# EAGLE design Quectel-2560-v2.3 (EAGLE 8.5.1)
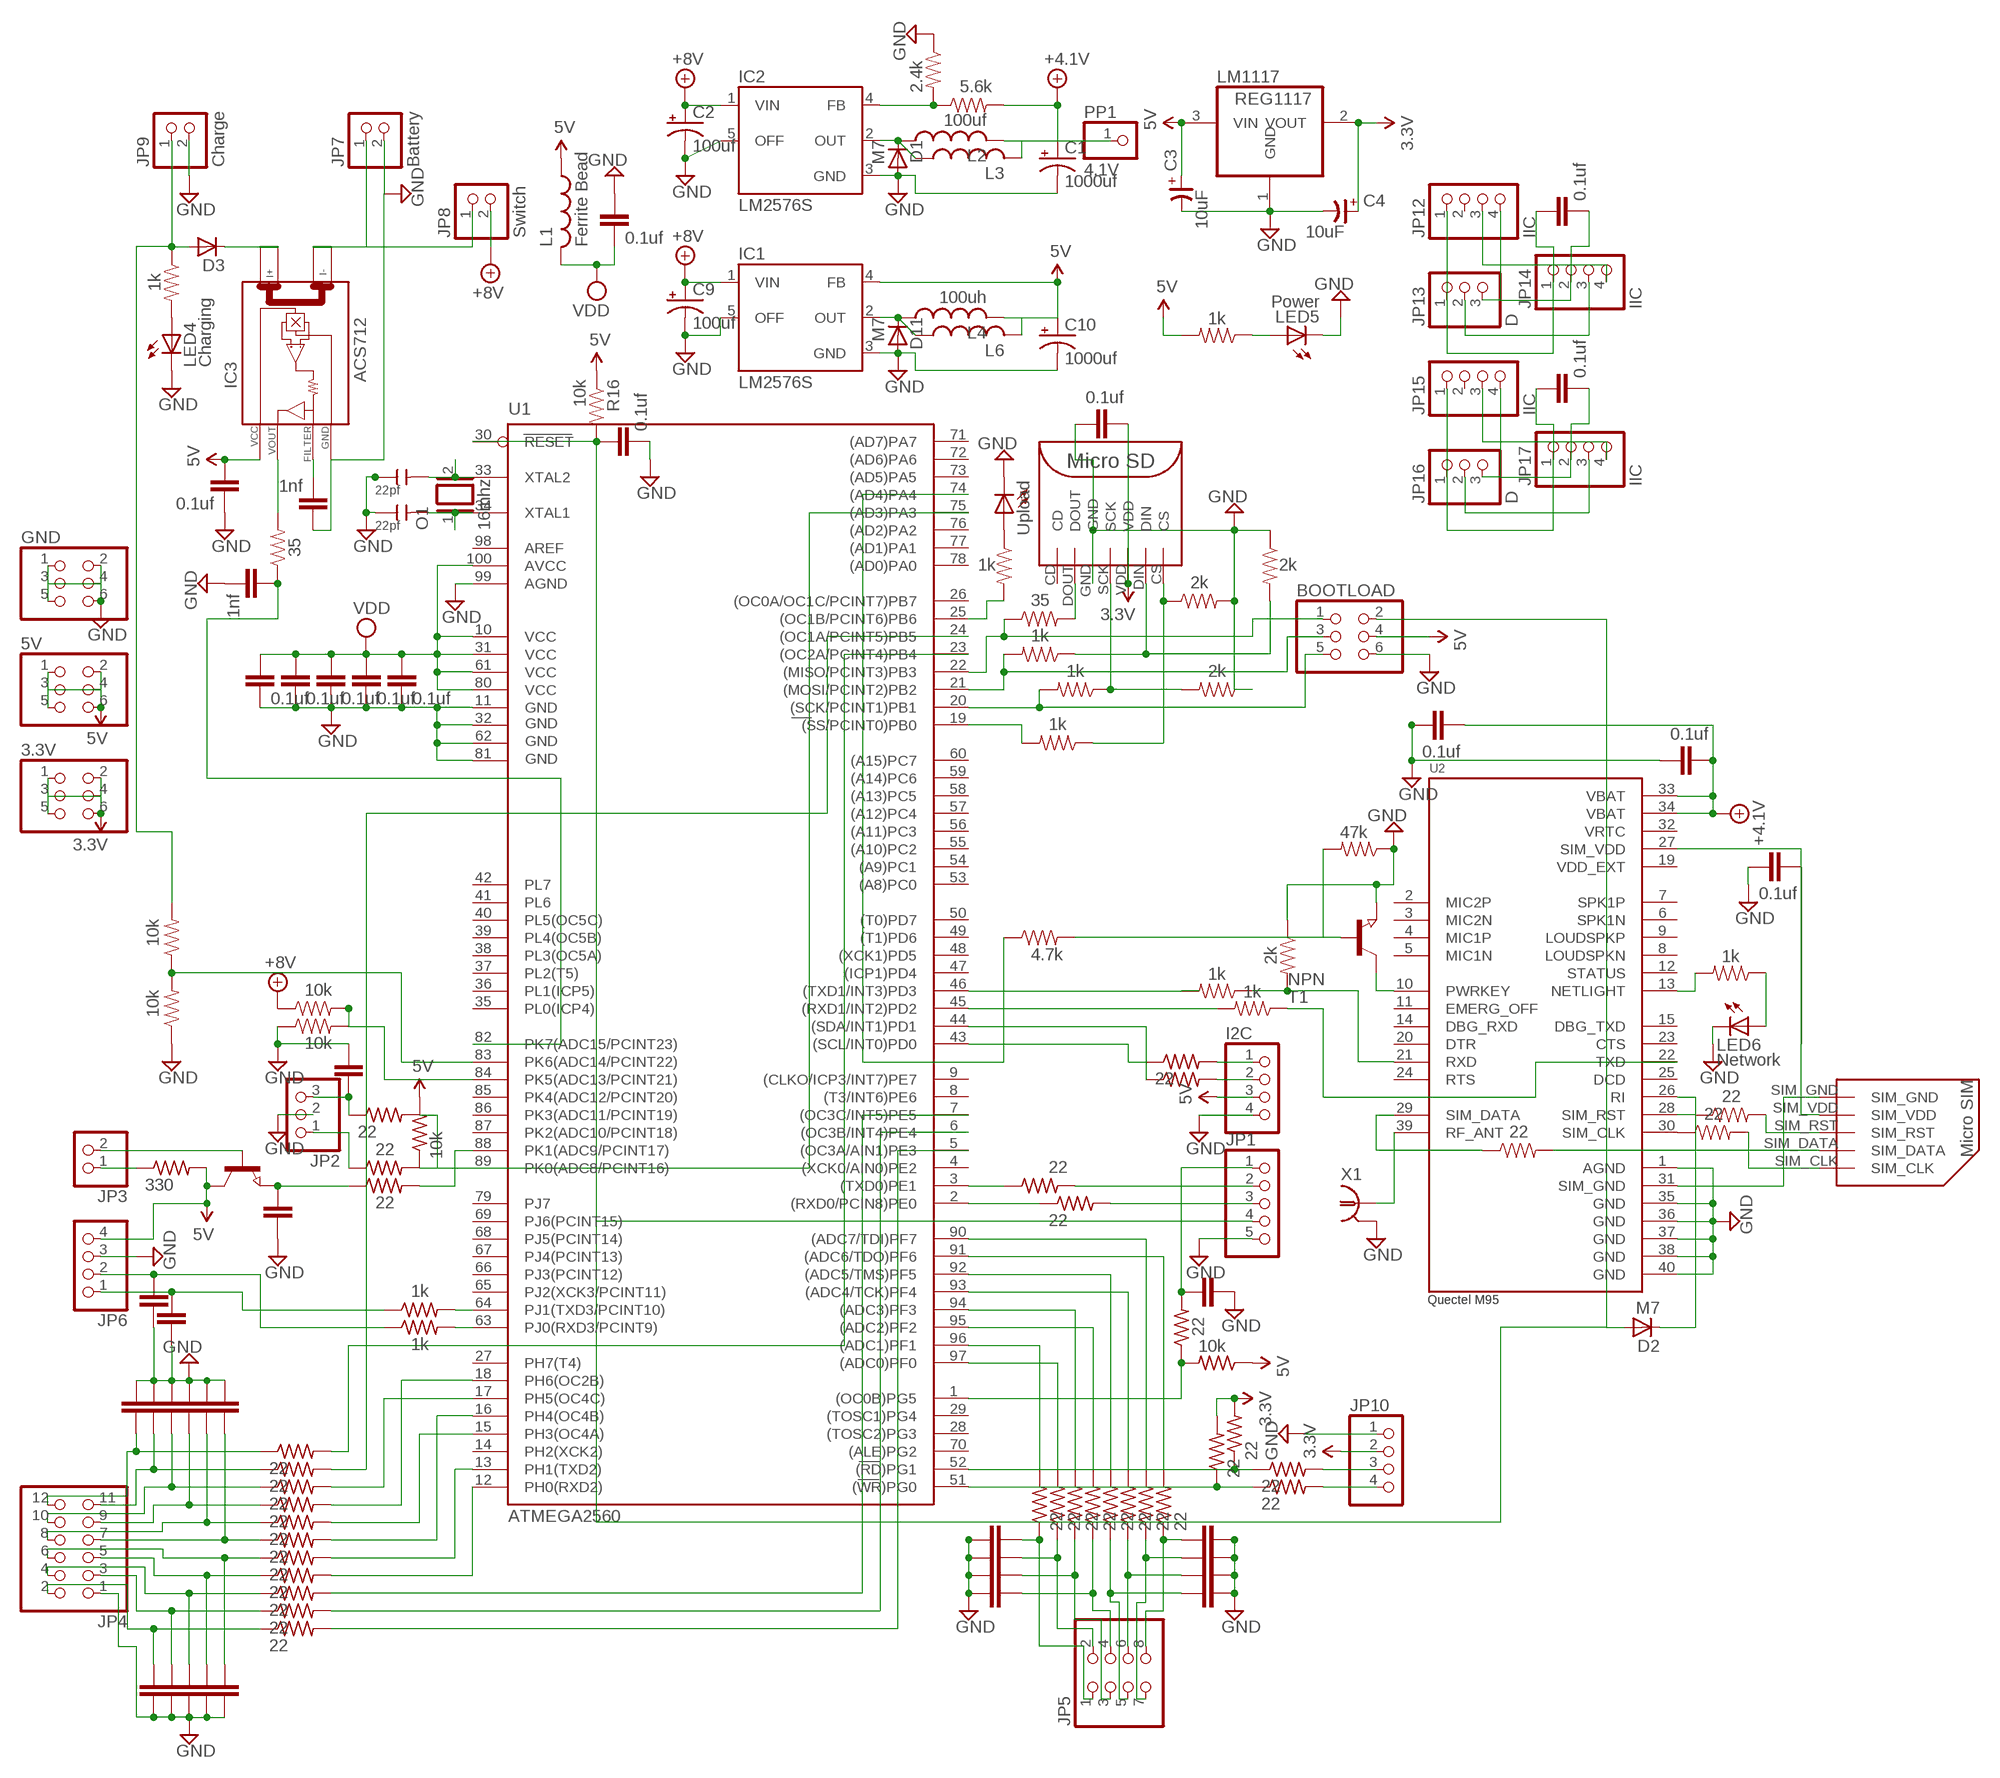
[diagram p0: schematic, sheet 1]

## Parts
3.3V  PINHD-2X3  [2X03]
5V  PINHD-2X3  [2X03]
BOOTLOAD  PINHD-2X3  [2X03]
C1  1000uf  CPOL-US153CLV-1012  [153CLV-1012]
C2  100uf  CPOL-USCT7343  [CT7343]
C3  10uF  CP-3528  [3528/T]
C4  10uF  CP-3528  [3528/T]
C7  22pf  CERAMIC-22PF-50V-5%-NPO(0805)  [C0805]
C8  22pf  CERAMIC-22PF-50V-5%-NPO(0805)  [C0805]
C9  100uf  CPOL-USCT7343  [CT7343]
C10  1000uf  CPOL-US153CLV-1012  [153CLV-1012]
D1  M7  BYS10  [SOD106A]
D2  M7  BYS10  [SOD106A]
D3  BYS10  [SOD106A]
D11  M7  BYS10  [SOD106A]
DC1  0.1uf  C-EUC0805  [C0805]
DC2  0.1uf  C-EUC0805  [C0805]
DC3  0.1uf  C-EUC0805  [C0805]
DC4  0.1uf  C-EUC0805  [C0805]
DC5  0.1uf  C-EUC0805  [C0805]
DC6  0.1uf  C-EUC0805  [C0805]
DC7  0.1uf  C-EUC0805  [C0805]
DC8  0.1uf  C-EUC0805  [C0805]
DC9  0.1uf  C-EUC0805  [C0805]
DC10  0.1uf  C-EUC0805  [C0805]
DC11  0.1uf  C-EUC0805  [C0805]
DC12  1nf  C-EUC0805  [C0805]
DC13  1nf  C-EUC0805  [C0805]
DC14  1nf  C-EUC0805  [C0805]
DC15  0.1uf  C-EUC0805  [C0805]
DC16  1nf  C-EUC0805  [C0805]
DC17  1nf  C-EUC0805  [C0805]
DC18  0.1uf  C-EUC0805  [C0805]
DC19  0.1uf  C-EUC0805  [C0805]
DC20  1nf  C-EUC0805  [C0805]
DC21  1nf  C-EUC0805  [C0805]
DC22  1nf  C-EUC0805  [C0805]
DC23  1nf  C-EUC0805  [C0805]
DC24  1nf  C-EUC0805  [C0805]
DC25  1nf  C-EUC0805  [C0805]
DC26  1nf  C-EUC0805  [C0805]
DC27  1nf  C-EUC0805  [C0805]
DC28  1nf  C-EUC0805  [C0805]
DC29  1nf  C-EUC0805  [C0805]
DC30  1nf  C-EUC0805  [C0805]
DC31  1nf  C-EUC0805  [C0805]
DC32  1nf  C-EUC0805  [C0805]
DC33  1nf  C-EUC0805  [C0805]
DC34  1nf  C-EUC0805  [C0805]
DC35  1nf  C-EUC0805  [C0805]
DC36  1nf  C-EUC0805  [C0805]
DC37  1nf  C-EUC0805  [C0805]
DC38  1nf  C-EUC0805  [C0805]
DC39  1nf  C-EUC0805  [C0805]
DC40  1nf  C-EUC0805  [C0805]
GND  PINHD-2X3  [2X03]
I2C  PINHD-1X4  [1X04]
IC1  LM2576S  [TO263-5]
IC2  LM2576S  [TO263-5]
IC3  ACS712  [SO08]
JP1  PINHD-1X5  [1X05]
JP2  PINHD-1X3  [1X03]
JP3  PINHD-1X2  [1X02]
JP4  PINHD-2X6  [2X06]
JP5  PINHD-2X4  [2X04]
JP6  PINHD-1X4  [1X04]
JP7  Battery  PINHD-1X2  [1X02]
JP8  Switch  PINHD-1X2  [1X02]
JP9  Charge  PINHD-1X2  [1X02]
JP10  PINHD-1X4  [1X04]
JP12  IIC  PINHD-1X4  [1X04]
JP13  D  PINHD-1X3  [1X03]
JP14  IIC  PINHD-1X4  [1X04]
JP15  IIC  PINHD-1X4  [1X04]
JP16  D  PINHD-1X3  [1X03]
JP17  IIC  PINHD-1X4  [1X04]
L1  Ferrite Bead  L-USL2012C  [L2012C]
L2  100uf  L-USPIS2816  [PIS2816]
L3  L-US6000-XXX-RC  [6000-XXXX-RC]
L4  100uh  L-USPIS2816  [PIS2816]
L6  L-US6000-XXX-RC  [6000-XXXX-RC]
LED2  Upload  LEDCHIP-LED0805  [CHIP-LED0805]
LED4  Charging  LEDCHIP-LED0805  [CHIP-LED0805]
LED5  Power  LEDCHIP-LED0805  [CHIP-LED0805]
LED6  Network  LEDCHIP-LED0805  [CHIP-LED0805]
LM1117  REG1117  [SOT223]
O1  16mhz  XTAL/S  [QS]
PP1  4.1V  PINHD-1X1  [1X01]
R1  35  RESISTOR0805-RES  [0805]
R2  47k  RESISTOR0805-RES  [0805]
R3  4.7k  RESISTOR0805-RES  [0805]
R4  22  R-US_R0805  [R0805]
R5  22  R-US_R0805  [R0805]
R6  1k  RESISTOR0805-RES  [0805]
R7  1k  RESISTOR0805-RES  [0805]
R8  1k  RESISTOR0805-RES  [0805]
R9  2k  RESISTOR0805-RES  [0805]
R10  22  RESISTOR0805-RES  [0805]
R11  22  RESISTOR0805-RES  [0805]
R12  22  R-US_R0805  [R0805]
R13  22  R-US_R0805  [R0805]
R14  1k  RESISTOR0805-RES  [0805]
R15  1k  RESISTOR0805-RES  [0805]
R16  10k  RESISTOR0805-RES  [0805]
R17  1k  RESISTOR0805-RES  [0805]
R18  1k  RESISTOR0805-RES  [0805]
R19  22  R-US_R0805  [R0805]
R20  22  R-US_R0805  [R0805]
R21  22  R-US_R0805  [R0805]
R22  22  R-US_R0805  [R0805]
R23  2k  RESISTOR0805-RES  [0805]
R24  2k  RESISTOR0805-RES  [0805]
R25  1k  RESISTOR0805-RES  [0805]
R26  1k  RESISTOR0805-RES  [0805]
R27  22  R-US_R0805  [R0805]
R28  22  R-US_R0805  [R0805]
R29  2k  RESISTOR0805-RES  [0805]
R30  22  R-US_R0805  [R0805]
R31  22  R-US_R0805  [R0805]
R32  22  R-US_R0805  [R0805]
R33  22  R-US_R0805  [R0805]
R34  22  R-US_R0805  [R0805]
R35  35  RESISTOR0805-RES  [0805]
R36  22  R-US_R0805  [R0805]
R37  22  R-US_R0805  [R0805]
R38  22  R-US_R0805  [R0805]
R39  22  R-US_R0805  [R0805]
R40  22  R-US_R0805  [R0805]
R41  22  R-US_R0805  [R0805]
R42  22  R-US_R0805  [R0805]
R43  10k  RESISTOR0805-RES  [0805]
R44  10k  RESISTOR0805-RES  [0805]
R45  2.4k  RESISTOR0805-RES  [0805]
R46  5.6k  RESISTOR0805-RES  [0805]
R47  22  RESISTOR0805-RES  [0805]
R48  22  R-US_R0805  [R0805]
R49  22  R-US_R0805  [R0805]
R50  10k  R-US_R0805  [R0805]
R51  22  R-US_R0805  [R0805]
R52  330  R-US_R0805  [R0805]
R53  22  R-US_R0805  [R0805]
R54  22  R-US_R0805  [R0805]
R55  10k  R-US_R0805  [R0805]
R56  10k  RESISTOR0805-RES  [0805]
R57  10k  RESISTOR0805-RES  [0805]
R58  1k  R-US_R0805  [R0805]
R59  1k  R-US_R0805  [R0805]
R60  22  R-US_R0805  [R0805]
R61  22  R-US_R0805  [R0805]
R62  22  R-US_R0805  [R0805]
R63  22  R-US_R0805  [R0805]
T1  NPN  NPN-TRANSISTOR_SOT23  [SOT23]
T2  NPN  NPN-TRANSISTOR_SOT23  [SOT23]
U1  ATMEGA2560  ATMEGA2560AU  [TQFP100]
U2  Quectel M95  M95  [XCVR_M95]
U$1  MICROSD  [MICROSD]
U$2  MICROSIM  [MICROSIM]
X1  LTI-SASF54GT  [LTI-SASF54GT]

## Nets
3.3V: 3.3V.1 3.3V.2 3.3V.3 3.3V.4 3.3V.5 3.3V.6 C4.+ DC10.2 JP10.2 LM1117.2(VOUT) R62.2 R63.2 U$1.VDD
5V: 5V.1 5V.2 5V.3 5V.4 5V.5 5V.6 BOOTLOAD.4 C3.+ C10.+ DC19.2 I2C.3 IC1.4(FB) IC3.8(VCC) JP6.4 L1.1 L4.2 L6.2 LM1117.3(VIN) R16.1 R18.2 R50.1 R52.2 R55.2 T2.3(C)
+4.1V: C1.+ DC6.2 DC7.2 L2.2 L3.2 PP1.1 R46.2 U2.33(VBAT) U2.34(VBAT)
+8V: C2.+ C9.+ IC1.1(VIN) IC2.1(VIN) JP8.2 R43.1
GND: BOOTLOAD.6 C1.- C2.- C3.- C4.- C7.1 C8.1 C9.- C10.- D1.A D11.A DC1.2 DC2.2 DC3.2 DC4.2 DC5.2 DC6.1 DC7.1 DC10.1 DC11.2 DC12.1 DC13.1 DC14.1 DC15.1 DC16.1 DC17.1 DC18.1 DC19.1 DC20.1 DC21.2 DC22.1 DC23.2 DC24.2 DC25.2 DC26.2 DC27.2 DC28.2 DC29.2 DC30.2 DC31.2 DC32.2 DC33.1 DC34.1 DC35.1 DC36.1 DC37.2 DC38.2 DC39.1 DC40.2 GND.1 GND.2 GND.3 GND.4 GND.5 GND.6 I2C.4 IC1.3(GND) IC1.5(OFF) IC2.3(GND) IC2.5(OFF) IC3.5(GND) JP1.5 JP2.2 JP4.1 JP6.3 JP7.2 JP9.2 JP10.1 LED2.C LED4.C LED5.C LED6.C LM1117.1(GND) R2.1 R9.1 R23.2 R24.1 R29.1 R44.1 R45.1 R57.1 T1.2(E) U1.11(GND) U1.32(GND1) U1.62(GND2) U1.81(GND3) U1.99(AGND) U2.1(AGND) U2.35(GND) U2.36(GND) U2.37(GND) U2.38(GND) U2.40(GND) U$1.GND X1.2 X1.3 X1.4 X1.5
N$1: U2.31(SIM_GND) U$2.SIM_GND
N$2: DC15.2 U2.27(SIM_VDD) U$2.SIM_VDD
N$3: R10.1 U2.28(SIM_RST)
N$4: R11.1 U2.30(SIM_CLK)
N$5: DC8.1 JP12.1 JP13.1 JP14.1
N$6: R10.2 U$2.SIM_RST
N$7: LED2.A R25.1
N$8: R33.1 R50.2 U1.1((OC0B)PG5)
N$9: R32.2 U1.5((OC3A/AIN1)PE3)
N$10: R7.1 R24.2 U$1.SCK
N$11: R31.2 U1.6((OC3B/INT4)PE4)
N$12: R6.1 R9.2 U$1.DIN
N$13: BOOTLOAD.2 D2.A DC11.1 JP1.4 R16.2 U1.30(RESET)
N$14: DC8.2 JP12.4 JP13.3 JP14.2
N$15: JP13.2 JP14.3
N$16: BOOTLOAD.3 R6.2 U1.21((MOSI/PCINT2)PB2)
N$17: BOOTLOAD.5 R7.2 U1.20((SCK/PCINT1)PB1)
N$18: DC21.1 R1.1 U1.82(PK7(ADC15/PCINT23))
N$19: IC3.4(I-_1) JP7.1 JP8.1
N$20: R8.2 U1.19((SS/PCINT0)PB0)
N$21: U2.39(RF_ANT) X1.1
N$22: R13.2 U1.18(PH6(OC2B))
N$23: R22.2 U1.12(PH0(RXD2))
N$25: D3.A JP9.1 R26.1 R56.2
N$26: R27.2 U1.96((ADC1)PF1)
N$27: LED4.A R26.2
N$28: IC3.7(VOUT) R1.2
N$29: R11.2 U$2.SIM_CLK
N$30: C7.2 O1.2 U1.33(XTAL2)
N$31: C8.2 O1.1 U1.34(XTAL1)
N$32: R21.2 U1.13(PH1(TXD2))
N$33: R28.2 U1.97((ADC0)PF0)
N$34: R34.2 U1.94((ADC3)PF3)
N$35: R8.1 R23.1 U$1.CS
N$36: R19.2 U1.15(PH3(OC4A))
N$37: R20.2 U1.16(PH4(OC4B))
N$38: R12.2 U1.17(PH5(OC4C))
N$39: R25.2 U1.25((OC1B/PCINT6)PB6)
N$40: R14.2 U1.46((TXD1/INT3)PD3)
N$41: R15.2 U1.45((RXD1/INT2)PD2)
N$42: R14.1 R29.2 U2.21(RXD)
N$43: R15.1 U2.22(TXD)
N$44: DC29.1 JP5.8 R40.1
N$45: R4.2 U1.23((OC2A/PCINT4)PB4)
N$46: JP12.3 JP14.4
N$47: R5.2 U1.24((OC1A/PCINT5)PB5)
N$48: R36.2 U1.95((ADC2)PF2)
N$49: BOOTLOAD.1 R35.1 U1.22((MISO/PCINT3)PB3)
N$50: R17.2 U2.13(NETLIGHT)
N$51: LED6.A R17.1
N$52: R41.1 U1.3((TXD0)PE1)
N$53: R42.1 U1.2((RXD0/PCIN8)PE0)
N$54: DC13.2 JP4.11 R5.1
N$55: DC23.1 JP1.1 R33.2
N$56: DC25.1 JP4.3 R31.1
N$57: DC27.1 JP4.5 R22.1
N$58: DC22.2 JP4.7 R20.1
N$60: LED5.A R18.1
N$61: DC16.2 JP4.9 R13.1
N$62: DC24.1 JP4.2 R32.1
N$63: JP1.2 R41.2
N$64: R35.2 U$1.DOUT
N$65: D11.K IC1.2(OUT) L4.1 L6.1
N$66: DC28.1 JP4.6 R21.1
N$67: R47.2 U$2.SIM_DATA
N$68: R47.1 U2.29(SIM_DATA)
N$69: DC17.2 JP4.8 R19.1
N$70: DC14.2 JP4.10 R12.1
N$71: DC12.2 JP4.12 R4.1
N$72: DC9.1 JP15.1 JP16.1 JP17.1
N$73: DC26.1 JP4.4 R30.1
N$74: JP1.3 R42.2
N$75: R30.2 U1.7((OC3C/INT5)PE5)
N$76: R43.2 R44.2 U1.84(PK5(ADC13/PCINT21))
N$77: D1.K IC2.2(OUT) L2.1 L3.1
N$78: IC2.4(FB) R45.2 R46.1
N$79: DC39.2 JP2.3 R51.1
N$80: I2C.1 R49.2
N$81: I2C.2 R48.2
N$82: DC9.2 JP15.4 JP16.3 JP17.2
N$83: JP15.3 JP17.4
N$84: JP16.2 JP17.3
N$85: T1.3(C) U2.10(PWRKEY)
N$86: R2.2 R3.2 T1.1(B)
N$87: R3.1 U1.74((AD4)PA4)
N$88: D2.K U2.26(RI)
N$89: DC31.1 JP5.6 R37.1
N$90: D3.K IC3.1(I+_0)
N$91: DC20.2 IC3.6(FILTER)
N$92: DC36.2 JP5.4 R36.1
N$93: DC34.2 JP5.2 R28.1
N$94: R48.1 U1.44((SDA/INT1)PD1)
N$95: R49.1 U1.43((SCL/INT0)PD0)
N$96: DC30.1 JP5.7 R39.1
N$97: DC32.1 JP5.5 R38.1
N$98: DC35.2 JP5.3 R34.1
N$99: DC33.2 JP5.1 R27.1
N$100: R38.2 U1.92((ADC5/TMS)PF5)
N$101: R37.2 U1.93((ADC4/TCK)PF4)
N$102: R39.2 U1.90((ADC7/TDI)PF7)
N$103: R40.2 U1.91((ADC6/TDO)PF6)
N$104: JP2.1 R54.1
N$105: JP3.1 R52.1
N$106: JP3.2 T2.1(B)
N$107: DC40.1 R53.1 T2.2(E)
N$108: R54.2 R55.1 U1.75((AD3)PA3)
N$109: R51.2 U1.89(PK0(ADC8/PCINT16))
N$110: R53.2 U1.88(PK1(ADC9/PCINT17))
N$111: R60.1 R62.1 U1.51((WR)PG0)
N$112: R56.1 R57.2 U1.83(PK6(ADC14/PCINT22))
N$113: R58.2 U1.64(PJ1(TXD3/PCINT10))
N$114: R59.2 U1.63(PJ0(RXD3/PCINT9))
N$115: DC38.1 JP6.1 R58.1
N$116: DC37.1 JP6.2 R59.1
N$117: R61.1 R63.1 U1.52((RD)PG1)
N$118: JP10.4 R60.2
N$119: JP10.3 R61.2
VDD: DC1.1 DC2.1 DC3.1 DC4.1 DC5.1 DC18.2 L1.2 U1.10(VCC) U1.31(VCC1) U1.61(VCC2) U1.80(VCC3) U1.100(AVCC)
Unconnected: IC3.2(I+_1) IC3.3(I-_0) JP12.2 JP15.2 U1.4((XCK0/AIN0)PE2) U1.8((T3/INT6)PE6) U1.9((CLKO/ICP3/INT7)PE7) U1.14(PH2(XCK2)) U1.26((OC0A/OC1C/PCINT7)PB7) U1.27(PH7(T4)) U1.28((TOSC2)PG3) U1.29((TOSC1)PG4) U1.35(PL0(ICP4)) U1.36(PL1(ICP5)) U1.37(PL2(T5)) U1.38(PL3(OC5A)) U1.39(PL4(OC5B)) U1.40(PL5(OC5C)) U1.41(PL6) U1.42(PL7) U1.47((ICP1)PD4) U1.48((XCK1)PD5) U1.49((T1)PD6) U1.50((T0)PD7) U1.53((A8)PC0) U1.54((A9)PC1) U1.55((A10)PC2) U1.56((A11)PC3) U1.57((A12)PC4) U1.58((A13)PC5) U1.59((A14)PC6) U1.60((A15)PC7) U1.65(PJ2(XCK3/PCINT11)) U1.66(PJ3(PCINT12)) U1.67(PJ4(PCINT13)) U1.68(PJ5(PCINT14)) U1.69(PJ6(PCINT15)) U1.70((ALE)PG2) U1.71((AD7)PA7) U1.72((AD6)PA6) U1.73((AD5)PA5) U1.76((AD2)PA2) U1.77((AD1)PA1) U1.78((AD0)PA0) U1.79(PJ7) U1.85(PK4(ADC12/PCINT20)) U1.86(PK3(ADC11/PCINT19)) U1.87(PK2(ADC10/PCINT18)) U1.98(AREF) U2.2(MIC2P) U2.3(MIC2N) U2.4(MIC1P) U2.5(MIC1N) U2.6(SPK1N) U2.7(SPK1P) U2.8(LOUDSPKN) U2.9(LOUDSPKP) U2.11(EMERG_OFF) U2.12(STATUS) U2.14(DBG_RXD) U2.15(DBG_TXD) U2.20(DTR) U2.23(CTS) U2.24(RTS) U2.25(DCD) U$1.CD

## Power pins joined to a net without a drawn wire
VDD_EXT: U2.19(VDD_EXT)
VRTC: U2.32(VRTC)

## Library data of the parts
3.3V 5V BOOTLOAD GND = pinhead:PINHD-2X3: PIN HEADER
C1 C2 C9 C10 = rcl:CPOL-US: POLARIZED CAPACITOR, American symbol
C3 C4 = cap-master:CP-: POLARIZED CAP
C7 C8 = Seeed-OPL-Capacitor:CERAMIC-22PF-50V-5%-NPO(0805): 302010151; MPN: CC0805JRNPO9BN220
D1-D3 D11 = telefunken:BYS10: DIODE; MPN: BYS10/45; OC_FARNELL: 9549188; OC_NEWARK: 96K7236
DC1-DC40 = resistor:C-EU: CAPACITOR, European symbol
I2C JP6 JP10 JP12 JP14 JP15 JP17 = pinhead:PINHD-1X4: PIN HEADER
IC1 IC2 = lm2576:LM2576: National Semiconductor <http://www.national.com> 3.0A "Simple Switcher"(c) 52kHz, Vout 1.23-37V (HV: 57V), Vin 40V (HV: 60V), 50µA standby current
IC3 = ACS712:ACS712
JP1 = pinhead:PINHD-1X5: PIN HEADER
JP2 JP13 JP16 = pinhead:PINHD-1X3: PIN HEADER
JP3 JP7-JP9 = pinhead:PINHD-1X2: PIN HEADER
JP4 = pinhead:PINHD-2X6: PIN HEADER
JP5 = pinhead:PINHD-2X4: PIN HEADER
L1-L4 L6 = rcl:L-US: INDUCTOR, American symbol
LED2 LED4-LED6 = led:LED: LED OSRAM: - CHIPLED LG R971, LG N971, LY N971, LG Q971, LY Q971, LO R971, LY R971 LH N974, LH R974 LS Q976, LO Q976, LY Q976 LO Q996 - Hyper CHIPLED LW Q18S LB Q993, LB Q99A, LB R99A - SideLED LS A670, LO A670, LY A670, LG A670, LP A670 LB A673, LV A673, LT A673, LW A673 LH A674 LY A675 LS A676, LA A676, LO A676, LY A676, LW A676 LS A679, LY A679, LG A679 - Hyper Micro SIDELED® LS Y876, LA Y876, LO Y876, LY Y876 LT Y87S - SmartLED LW L88C, LW L88S LB L89C, LB L89S, LG L890 LS L89K, LO L89K, LY L89K LS L896, LA L896, LO L896, LY L896 - TOPLED LS T670, LO T670, LY T670, LG T670, LP T670 LSG T670, LSP T670, LSY T670, LOP T670, LYG T670 LG T671, LOG T671, LSG T671 LB T673, LV T673, LT T673, LW T673 LH T674 LS T676, LA T676, LO T676, LY T676, LB T676, LH T676, LSB T676, LW T676 LB T67C, LV T67C, LT T67C, LS T67K, LO T67K, LY T67K, LW E67C LS E67B, LA E67B, LO E67B, LY E67B, LB E67C, LV E67C, LT E67C LW T67C LS T679, LY T679, LG T679 LS T770, LO T770, LY T770, LG T770, LP T770 LB T773, LV T773, LT T773, LW T773 LH T774 LS E675, LA E675, LY E675, LS T675 LS T776, LA T776, LO T776, LY T776, LB T776 LHGB T686 LT T68C, LB T68C - Hyper Mini TOPLED® LB M676 - Mini TOPLED Santana® LG M470 LS M47K, LO M47K, LY M47K Source: http://www.osram.convergy.de LUXEON: - LUMILED® LXK2-PW12-R00, LXK2-PW12-S00, LXK2-PW14-U00, LXK2-PW14-V00 LXK2-PM12-R00, LXK2-PM12-S00, LXK2-PM14-U00 LXK2-PE12-Q00, LXK2-PE12-R00, LXK2-PE12-S00, LXK2-PE14-T00, LXK2-PE14-U00 LXK2-PB12-K00, LXK2-PB12-L00, LXK2-PB12-M00, LXK2-PB14-N00, LXK2-PB14-P00, LXK2-PB14-Q00 LXK2-PR12-L00, LXK2-PR12-M00, LXK2-PR14-Q00, LXK2-PR14-R00 LXK2-PD12-Q00, LXK2-PD12-R00, LXK2-PD12-S00 LXK2-PH12-R00, LXK2-PH12-S00 LXK2-PL12-P00, LXK2-PL12-Q00, LXK2-PL12-R00 Source: www.luxeon.com KINGBRIGHT: KA-3528ASYC Source: www.kingbright.com
LM1117 = burr-brown:REG1117: 800mA and 1A Low Dropout (LDO) Positive Regulator 1.8V, 2.5V, 2.85V, 3.3V, 5V, and Adj; MPN: REG1117; OC_FARNELL: 1097566; OC_NEWARK: 14P6981
O1 = special:XTAL/S: CRYSTAL
PP1 = pinhead:PINHD-1X1: PIN HEADER
R1-R3 R6-R11 R14-R18 R23-R26 R29 R35 R43-R47 R56 R57 = SparkFun-Resistors:RESISTOR: Resistor Basic schematic elements and footprints for 0603, 1206, and PTH resistors.
R4 R5 R12 R13 R19-R22 R27 R28 R30-R34 R36-R42 R48-R55 R58-R63 = rcl:R-US_: RESISTOR, American symbol; SPICEPREFIX: R
T1 T2 = semicon-smd-ipc:NPN-TRANSISTOR_: NPN TRANSISTOR
U1 = SparkFun-DigitalIC:ATMEGA2560: Atmel 100-pin 8-bit uC 64/128/256 Kbytes FLASH 4 Kbytes EEPROM 8 Kbytes SRAM 86 General Purpose I/O pins 12-channels16-bit PWM 4 x Serial USARTs 16-channels 10-bit A/D; PROD_ID: IC-10040
U2 = M95:M95: Quad-Band GSM/GPRS Module LCC
U$1 = MicroSD:MICROSD
U$2 = MicroSD:MICROSIM
X1 = con-coax:LTI-SASF54GT: SMA vertical PCB thrue hole jack Source: Lighthorse Technologies, inc. SASF54GT.pdf; OC_FARNELL: unknown; OC_NEWARK: unknown

## Net classes
0 default: clearance 0.205 mm

## Board
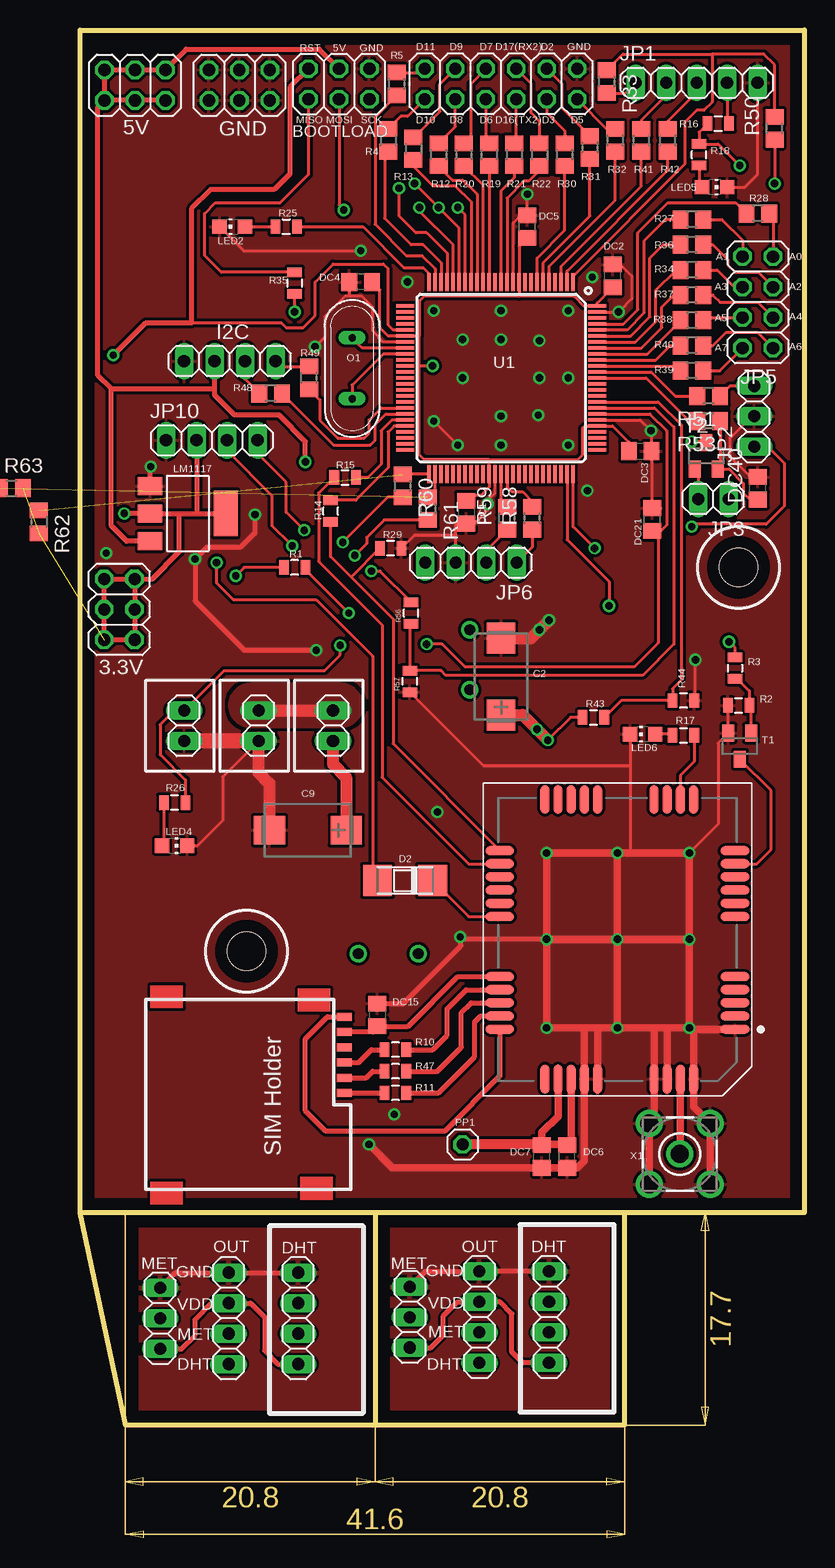
[diagram p1: board, top side]
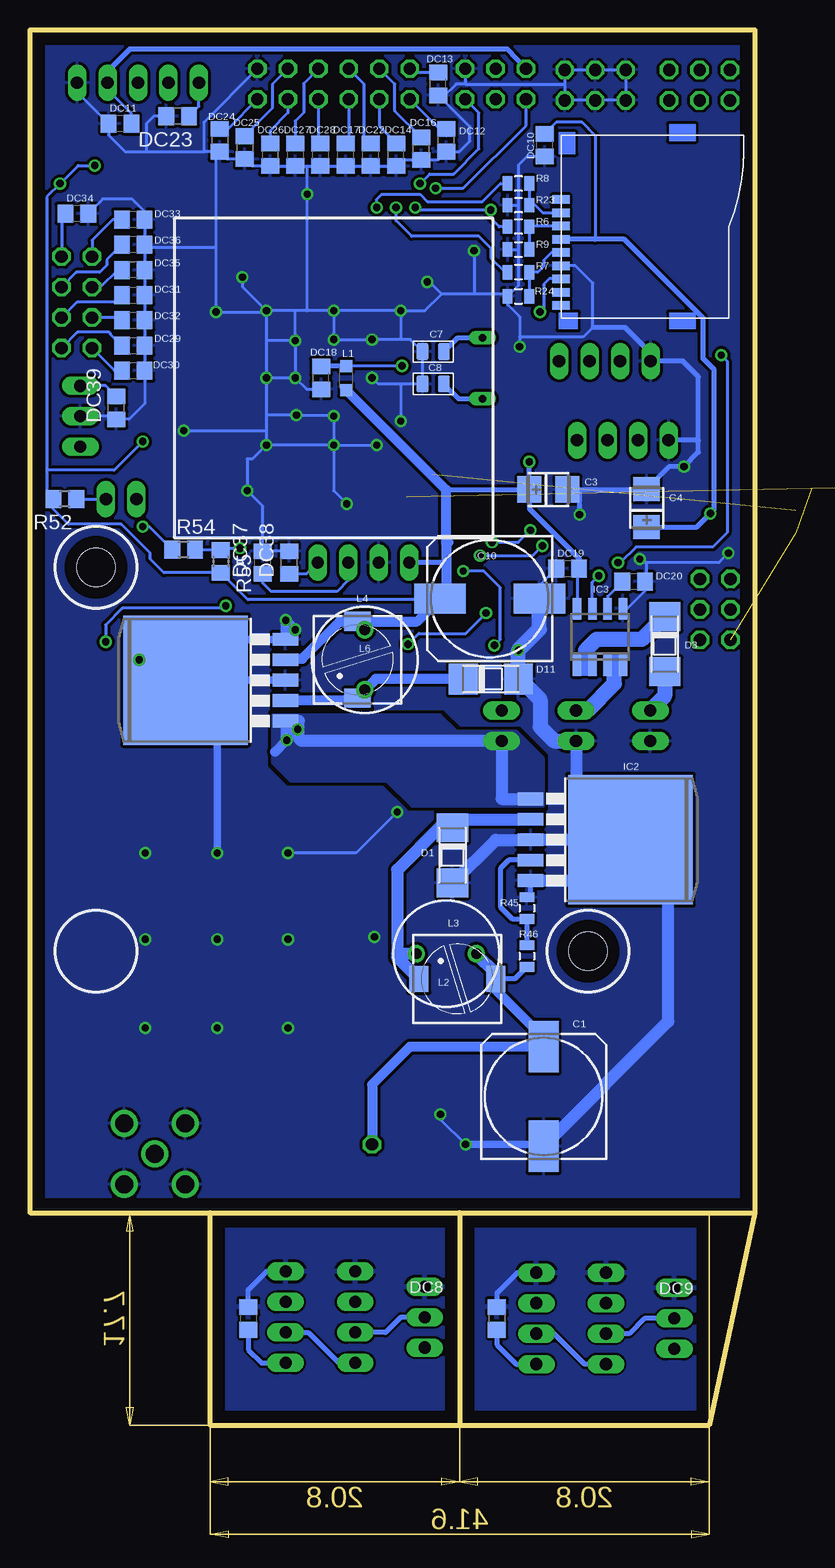
[diagram p2: board, bottom side, seen from below]

Size 60.4 x 116.3 mm. Coordinates in mm from the lower left corner, seen from the top.
Outline: 45.4,17.7 60.4,17.7 60.4,116.3 0,116.3 0,17.7
Outline: 45.4,17.7 24.6,17.7
Outline: 24.6,17.7 0,17.7
Outline: 24.6,0 45.4,0 45.4,17.7
Outline: 24.6,0 3.8,0 0,17.7
Outline: 24.6,17.7 24.6,0
Copper layers (1*16): Top 0.035mm / dielectric 1mm / Bottom 0.035mm
Design rules "Quectel-2560-v2.1": minimum track width 10mil, minimum drill 24mil, track to track 0.205mm, track to pad 0.205mm, pad to pad 0.205mm, via to via 0.205mm, smd to smd 8mil, copper to edge 40mil, drill to drill 8mil, minimum pad ring 10mil, minimum via ring 8mil, stop-mask expansion 4mil, vias tented up to drill 0mil, thermal gap 10mil
Holes 3.2 mm at 13.9,39.5 54.9,71.5

### Footprints (pad centres in the part's own frame; a part is rotated, then mirrored left to right if it is on the bottom)
2X03 = drill 1.016 octagon: 1 -2.54,-1.27; 2 -2.54,1.27; 3 0,-1.27; 4 0,1.27; 5 2.54,-1.27; 6 2.54,1.27
153CLV-1012 = smd 4.3 x 2.5: + 4.15,0; - -4.15,0
CT7343 = smd 2.6 x 2.4: + -3.2,0; - 3.2,0
3528/T = smd 2 x 2.2: + 1.587,0; - -1.587,0
C0805 = smd 1.397 x 1.016: 1 0,0.889; 2 0,-0.889
SOD106A = smd 2.4 x 2.6: A 2.3,0; K -2.3,0
C0805' = smd 1.3 x 1.5: 1 -0.95,0; 2 0.95,0
1X04 = drill 1.016 long: 1 -3.81,0; 2 -1.27,0; 3 1.27,0; 4 3.81,0
TO263-5 = smd 1.067 x 2.159: 1 -3.404,-5.791; 2 -1.702,-5.791; 3 0,-5.791; 4 1.702,-5.791; 5 3.404,-5.791 | smd 10.8 x 10.41: 6 0,2.54
SO08 = smd 0.72 x 1.78: 1 -1.905,-2.35; 2 -0.635,-2.35; 3 0.635,-2.35; 4 1.905,-2.35; 5 1.905,2.35; 6 0.635,2.35; 7 -0.635,2.35; 8 -1.905,2.35
1X05 = drill 1.016 long: 1 -5.08,0; 2 -2.54,0; 3 0,0; 4 2.54,0; 5 5.08,0
1X03 = drill 1.016 long: 1 -2.54,0; 2 0,0; 3 2.54,0
1X02 = drill 1.016 long: 1 -1.27,0; 2 1.27,0
2X06 = drill 1.016 octagon: 1 -6.35,-1.27; 2 -6.35,1.27; 3 -3.81,-1.27; 4 -3.81,1.27; 5 -1.27,-1.27; 6 -1.27,1.27; 7 1.27,-1.27; 8 1.27,1.27; 9 3.81,-1.27; 10 3.81,1.27; 11 6.35,-1.27; 12 6.35,1.27
2X04 = drill 1.016 octagon: 1 -3.81,-1.27; 2 -3.81,1.27; 3 -1.27,-1.27; 4 -1.27,1.27; 5 1.27,-1.27; 6 1.27,1.27; 7 3.81,-1.27; 8 3.81,1.27
L2012C = smd 1 x 1: 1 -1,0; 2 1,0
PIS2816 = smd 2.2 x 1.6: 1 0,3.2; 2 0,-3.2
6000-XXXX-RC = drill 0.9 pad 1.422: 1 -2.5,0; 2 2.5,0
CHIP-LED0805 = smd 1.2 x 1.2: A 0,-1.05; C 0,1.05
SOT223 = smd 1.499 x 2.007: 1 -2.261,-3.15; 2 0.025,-3.15; 3 2.311,-3.15 | smd 3.81 x 2.007: 4 0,3.15
QS = drill 0.61 long: 1 -2.54,0; 2 2.54,0
1X01 = drill 1.016 octagon: 1 0,0
0805 = smd 0.8 x 1.2: 1 -0.9,0; 2 0.9,0
R0805 = smd 1.3 x 1.5: 1 -0.95,0; 2 0.95,0
SOT23 = smd 1 x 1.4: 1 -0.95,-1.1; 2 0.95,-1.1; 3 0,1.1
TQFP100 = smd 1.5 x 0.3: 1 -8,6; 2 -8,5.5; 3 -8,5; 4 -8,4.5; 5 -8,4; 6 -8,3.5; 7 -8,3; 8 -8,2.5; 9 -8,2; 10 -8,1.5; 11 -8,1; 12 -8,0.5; 13 -8,0; 14 -8,-0.5; 15 -8,-1; 16 -8,-1.5; 17 -8,-2; 18 -8,-2.5; 19 -8,-3; 20 -8,-3.5; 21 -8,-4; 22 -8,-4.5; 23 -8,-5; 24 -8,-5.5; 25 -8,-6; 51 8,-6; 52 8,-5.5; 53 8,-5; 54 8,-4.5; 55 8,-4; 56 8,-3.5; 57 8,-3; 58 8,-2.5; 59 8,-2; 60 8,-1.5; 61 8,-1; 62 8,-0.5; 63 8,0; 64 8,0.5; 65 8,1; 66 8,1.5; 67 8,2; 68 8,2.5; 69 8,3; 70 8,3.5; 71 8,4; 72 8,4.5; 73 8,5; 74 8,5.5; 75 8,6 | smd 0.3 x 1.5: 26 -6,-8; 27 -5.5,-8; 28 -5,-8; 29 -4.5,-8; 30 -4,-8; 31 -3.5,-8; 32 -3,-8; 33 -2.5,-8; 34 -2,-8; 35 -1.5,-8; 36 -1,-8; 37 -0.5,-8; 38 0,-8; 39 0.5,-8; 40 1,-8; 41 1.5,-8; 42 2,-8; 43 2.5,-8; 44 3,-8; 45 3.5,-8; 46 4,-8; 47 4.5,-8; 48 5,-8; 49 5.5,-8; 50 6,-8; 76 6,8; 77 5.5,8; 78 5,8; 79 4.5,8; 80 4,8; 81 3.5,8; 82 3,8; 83 2.5,8; 84 2,8; 85 1.5,8; 86 1,8; 87 0.5,8; 88 0,8; 89 -0.5,8; 90 -1,8; 91 -1.5,8; 92 -2,8; 93 -2.5,8; 94 -3,8; 95 -3.5,8; 96 -4,8; 97 -4.5,8; 98 -5,8; 99 -5.5,8; 100 -6,8
XCVR_M95 = smd 2.4 x 0.75: 1 -9.8,7.5; 2 -9.8,6.4; 3 -9.8,5.3; 4 -9.8,4.2; 5 -9.8,3.1; 6 -9.8,-1.9; 7 -9.8,-3; 8 -9.8,-4.1; 9 -9.8,-5.2; 10 -9.8,-6.3; 11 -9.8,-7.4; 21 9.8,-7.4; 22 9.8,-6.3; 23 9.8,-5.2; 24 9.8,-4.1; 25 9.8,-3; 26 9.8,-1.9; 27 9.8,3.1; 28 9.8,4.2; 29 9.8,5.3; 30 9.8,6.4; 31 9.8,7.5 | smd 0.75 x 2.4: 12 -6.35,-11.65; 13 -5.25,-11.65; 14 -4.15,-11.65; 15 -3.05,-11.65; 16 1.65,-11.65; 17 2.75,-11.65; 18 3.85,-11.65; 19 4.95,-11.65; 20 6.05,-11.65; 32 6.05,11.65; 33 4.95,11.65; 34 3.85,11.65; 35 2.75,11.65; 36 1.65,11.65; 37 -3.05,11.65; 38 -4.15,11.65; 39 -5.25,11.65; 40 -6.35,11.65
MICROSD = smd 1.422 x 0.711: CD -6.35,-6.553; CS -6.35,1.143; DIN -6.35,0.051; DOUT -6.35,-4.343; GND -6.35,-3.251; P$3 -6.35,2.261; P$8 -6.35,-4.343; P$9 -6.35,-4.343; P$10 -6.35,-5.461; SCK -6.35,-2.159; VDD -6.35,-1.041
MICROSIM = smd 0.66 x 1.27: NC -3.29,9.23; SIM_CLK 0.515,9.23; SIM_DATA -0.76,9.23; SIM_GND -5.83,9.23; SIM_RST -2.025,9.23; SIM_VDD -4.565,9.23
LTI-SASF54GT = drill 1.5 pad 2.2: 1 0,0; 2 -2.54,2.54; 3 2.54,2.54; 4 2.54,-2.54; 5 -2.54,-2.54

### Placement (x,y rotation side)
3.3V  3.3,68 90 top
5V  4.6,111.7 0 top
BOOTLOAD  21.6,111.8 0 top
C1  17.6,27.4 90 bottom
C2  35.1,62.4 90 top
C3  17.2,78 180 bottom
C4  9.01,76.46 270 bottom
C7  26.8,89.49 90 bottom
C8  26.8,86.8 90 bottom
C9  19,49.6 180 top
C10  22.1,68.9 180 bottom
D1  25.2,47.5 270 bottom
D2  27.1,45.4 180 top
D3  7.51,65.11 270 bottom
D11  22,62.2 0 bottom
DC1  0.1uf  [C0805']  32.2,76.1 270 top
DC2  0.1uf  [C0805']  44.4,95.8 90 top
DC3  0.1uf  [C0805']  46.7,81.2 0 top
DC4  0.1uf  [C0805']  23.4,95.3 180 top
DC5  0.1uf  [C0805']  37.3,99.9 90 top
DC6  0.1uf  [C0805']  40.6,22.4 90 top
DC7  0.1uf  [C0805']  38.5,22.4 90 top
DC8  0.1uf  [C0805']  42.2,8.9 270 bottom
DC9  0.1uf  [C0805']  21.5,8.9 270 bottom
DC10  0.1uf  [C0805']  17.5,106.7 90 bottom
DC11  0.1uf  [C0805']  52.9,108.5 180 bottom
DC12  1nf  [C0805']  25.7,107.1 90 bottom
DC13  1nf  [C0805']  26.4,111.8 90 bottom
DC14  1nf  [C0805']  29.9,105.9 90 bottom
DC15  0.1uf  [C0805']  24.8,34.2 270 top
DC16  1nf  [C0805']  27.8,106.4 90 bottom
DC17  1nf  [C0805']  34.1,105.9 90 bottom
DC18  0.1uf  [C0805']  36.15,87.3 90 bottom
DC19  0.1uf  [C0805']  15.6,71.4 0 bottom
DC20  1nf  [C0805']  10.1,70.3 180 bottom
DC21  1nf  [C0805']  47.7,75.5 90 top
DC22  1nf  [C0805']  32,105.9 90 bottom
DC23  1nf  [C0805']  48.1,109.1 180 bottom
DC24  1nf  [C0805']  44.6,107.1 270 bottom
DC25  1nf  [C0805']  42.5,106.5 270 bottom
DC26  1nf  [C0805']  40.4,105.9 270 bottom
DC27  1nf  [C0805']  38.3,105.9 270 bottom
DC28  1nf  [C0805']  36.2,105.9 270 bottom
DC29  1nf  [C0805']  51.8,90 0 bottom
DC30  1nf  [C0805']  51.8,87.9 0 bottom
DC31  1nf  [C0805']  51.8,94.2 0 bottom
DC32  1nf  [C0805']  51.8,92.1 0 bottom
DC33  1nf  [C0805']  51.8,100.5 180 bottom
DC34  1nf  [C0805']  56.5,101 180 bottom
DC35  1nf  [C0805']  51.8,96.3 180 bottom
DC36  1nf  [C0805']  51.8,98.4 180 bottom
DC37  1nf  [C0805']  41,71.9 90 bottom
DC38  1nf  [C0805']  38.8,71.9 90 bottom
DC39  1nf  [C0805']  53.2,84.8 90 bottom
DC40  1nf  [C0805']  56.5,78.1 90 top
GND  13.3,111.7 0 top
I2C  12.5,88.7 180 top
IC1  44.9,62.1 90 bottom
IC2  12.9,48.8 270 bottom
IC3  12.9,65.7 0 bottom
JP1  51.4,111.9 0 top
JP2  56.2,84.1 90 top
JP3  52.8,77.2 180 top
JP4  35.1,111.8 180 top
JP5  56.5,93.6 270 top
JP6  32.6,71.9 180 top
JP7  14.9,58.3 270 top
JP8  21.1,58.3 270 top
JP9  8.7,58.3 270 top
JP10  11,82.1 0 top
JP12  39.1,9 270 top
JP13  27.5,9 270 top
JP14  33.3,9 270 top
JP15  18.2,8.9 270 top
JP16  6.7,8.9 270 top
JP17  12.4,8.9 270 top
L1  34.05,87.3 90 bottom
L2  24.8,37.2 90 bottom
L3  25.7,39.3 0 bottom
L4  33.1,63.8 180 bottom
L6  32.5,63.8 90 bottom
LED2  12.7,99.9 90 top
LED4  7.9,48.3 270 top
LED5  52.9,103.2 270 top
LED6  46.9,57.6 90 top
LM1117  9,76 270 top
O1  22.7,88.1 90 top
PP1  31.9,23.4 0 top
R1  17.9,71.5 180 top
R2  54.9,60 0 top
R3  54.6,63.1 270 top
R4  25.7,107.1 270 top
R5  26.4,111.8 270 top
R6  19.7,99.9 180 bottom
R7  19.7,96.1 180 bottom
R8  19.7,103.5 180 bottom
R9  19.7,98 0 bottom
R10  26.3,31.3 180 top
R11  26.3,27.7 180 top
R12  29.9,105.9 270 top
R13  27.8,106.4 270 top
R14  20.9,76.2 90 top
R15  22.1,79 0 top
R16  53.2,108.5 0 top
R17  50.3,57.5 0 top
R18  51.6,105.9 90 top
R19  34.1,105.9 270 top
R20  32,105.9 270 top
R21  36.2,105.9 270 top
R22  38.3,105.9 270 top
R23  19.7,101.7 180 bottom
R24  19.7,94.1 0 bottom
R25  17.2,99.9 0 top
R26  7.9,51.9 180 top
R27  51,100.5 180 top
R28  56.5,101 180 top
R29  25.9,73.1 180 top
R30  40.4,105.9 270 top
R31  42.5,106.5 270 top
R32  44.6,107.1 270 top
R33  43.9,112 270 top
R34  51,96.3 180 top
R35  17.9,95.2 270 top
R36  51,98.4 180 top
R37  51,94.2 180 top
R38  51,92.1 180 top
R39  51,87.9 180 top
R40  51,90 180 top
R41  46.8,107.1 90 top
R42  49,107.1 90 top
R43  42.8,59 0 top
R44  50.3,60.4 180 top
R45  19,43.1 270 bottom
R46  19,39.1 270 bottom
R47  26.3,29.5 180 top
R48  15.9,86 180 top
R49  19.1,87.3 90 top
R50  57.9,108.1 90 top
R51  52.4,85.8 180 top
R52  57.5,77.2 180 bottom
R53  52.4,83.7 180 top
R54  47.6,73 0 bottom
R55  44.5,72 270 bottom
R56  27.6,67.7 90 top
R57  27.5,62 90 top
R58  37.7,75.6 90 top
R59  35.6,75.6 90 top
R60  26.9,78.3 270 top
R61  29,76.4 270 top
R62  -3.4,75.3 270 top  (outside the outline)
R63  -5.7,78.1 0 top  (outside the outline)
T1  55,56.6 180 top
T2  52.2,80.8 0 top
U1  35.1,87.3 270 top
U2  44.8,40.5 180 top
U$1  9.8,99.9 0 bottom
U$2  12.8,28.2 270 top
X1  50,22.6 0 top

### Tracks (layer width: path | path; a pad name or v marks a point on that pad's centre or on a via)
3.3V  (via drill 0.6)  (2 unrouted)
  Top 0.406: v3.7,76 5.82,76 LM1117.2 8.3,75.97 | 8.3,75.97 9.7,75.97 | 9.7,75.97 12.07,75.97 12.1,76 | 3.3V.5 3.3V.6 3.3V.4 3.3V.2 3.3V.1 3.3V.3 3.3V.5 | 3.3V.5 6.04,70.54 8.3,72.8 8.3,75.97 | JP10.2 9.73,76 9.7,75.97
  Bottom 0.254: DC10.2 16.55,108.6 14.4,108.6 13.3,107.5 13.3,98.86
  Bottom 0.406: C4.+ 4.83,74.87 v3.7,76 3.4,76.3 3.4,88 4.3,88.9 4.3,92.3 10.86,98.86 13.3,98.86 U$1.VDD
5V  (via drill 0.6)
  Top 0.254: R16.1 51.6,107.8 R18.2 53.2,106.8 v55,105 | R50.1 v57.9,103.5 | T2.3 52.2,82 v51,82
  Top 0.406: LM1117.3 3.91,73.69 2.6,75 2.6,86.4 | 2.6,86.4 1.5,87.5 1.5,109.87 5V.1 | BOOTLOAD.4 19.97,114.7 8.87,114.7 5V.6 5V.4 5V.2 5V.1 | 5V.5 5V.3 5V.1 | v18.8,80.3 18.8,82 16.6,84.2 12.9,84.2 11.23,85.87 11.23,86.4 | 11.23,86.4 I2C.3 | 2.6,86.4 11.23,86.4
  Bottom 0.254: 25.7,68.9 25.8,68.8 42.25,68.8 R55.2 49.25,71.05 50.4,72.2 50.4,72.7 52.8,75.1 57.2,75.1 58.45,76.35 R52.2 59,77.75 59,79.6 | IC3.8 14.8,71.25 DC19.2 14.9,71.65 | C3.+ 18.8,78.01 | v55,105 56.4,105 v57.9,103.5 59,102.4 59,79.6 | v51,82 53.4,79.6 59,79.6
  Bottom 0.406: C10.+ 25.7,68.9 25.4,68.9 | 26.89,68.9 C10.+ | 26.7,69.35 C10.+ | 25.7,77.9 25.7,78 C3.+ 18.79,76.39 14.65,72.25 DC19.2 | 18.8,78.01 v18.8,80.3 | 25.7,71.8 25.8,71.9 JP6.4
  Bottom 0.61: 26.45,68.7 C10.+ | 39.01,63.9 IC1.4
  Bottom 0.813: L1.1 25.7,77.95 25.7,77.9 25.7,73.4 | 25.7,73.4 25.7,71.8 25.7,68.9 | 25.51,73.59 25.7,73.4 | 39.01,63.9 37.7,63.9 34.6,67 L4.2 | L4.2 32.5,66.4 L6.2 | L4.2 28.15,67 C10.+
+4.1V
  Top 0.61: DC6.2 40.95,23.6 U2.34 40.95,23.3 | U2.33 39.85,25.75 38.5,24.4 DC7.2 38.55,23.4 40.55,23.4
  Top 0.813: DC7.2 38.45,23.4 PP1.1 | 40.55,23.4 DC6.2
  Bottom 0.406: R46.2 20,37.2 L2.2
  Bottom 0.813: PP1.1 31.9,28.4 28.75,31.55 C1.+ 17.6,32.3 21.6,36.3 L2.2
  Bottom 1.016: 17.6,31.9 C1.+ | L3.2 21.6,37.7 L2.2
+8V  (via drill 0.6)
  Top 0.254: R43.1 40.9,59 v39,57.1
  Top 1.016: JP8.2 21.1,55.1 22.2,54 C9.+ | C2.+ 36.9,59.2 v39,57.1
  Bottom 0.813: 39.98,56.12 v39,57.1
  Bottom 1.016: IC2.1 21.1,52.2 JP8.2 37.8,57.03 38,57.23 38,58.7 IC1.1 39,58.59 v39,57.1
  other vias: 38.1,58
  pour Bottom (isolate 0.254, no thermals): 17.6,51.6 17.6,55.6 19.8,57.8 24.8,57.8 26.2,59.2 40.2,59.2 40.2,55.2 38.7,53.7 30.7,53.7 28.6,51.6
GND  (via drill 0.6)
  Top 0.254: U1.99 v44.9,92.8 46,93.9 46,95.8 45.05,96.75 DC2.2 | U1.62 34.6,77.7 34,77.1 v34,76.8 34,76.3 32.85,75.15 DC1.2 31.4,75.15 31.33,75.08 31.33,74.2 | U1.32 25.3,90.3 24.4,91.2 24.4,93.2 23.5,94.1 22.45,94.1 | 22.45,94.1 22.1,94.1 20.4,92.4 20.4,90.7 v19.6,89.9 | DC4.2 22.45,94.1 | LED6.C 45.85,55 | 45.85,55 45.85,47.75 45.8,47.7 | v29.5,83.7 v31.5,81.7 | v31.7,40.7 31.75,40.65 | v50.8,47.7 53.2,50.1 53.2,56.85 T1.2 54,57.75 R2.1 | U1.11 36.1,100.2 36.75,100.85 DC5.2 v37.3,102.6 | LED2.C 13.65,97.9 v23.4,97.9 | 47.64,81.14 DC3.2 47.65,76.6 DC21.2 48.2,76.5 | 47.64,81.14 47.6,80.85 | U1.81 46.7,83.8 v47.6,82.9 47.6,81.18 47.64,81.14 | JP7.2 11.9,54.03 11.9,50.4 9.8,48.3 LED4.C 8.8,48.15 | LED5.C 55.4,103.2 56.48,104.28 JP1.5 | R44.1 51.3,60.5 v51.3,63.8 | R57.1 33.6,55 45.85,55 | DC40.2 55.85,79.05 54.2,80.7 54.2,82.3 56,84.1 JP2.2 | JP6.3 31.33,74.2 | R29.1 27.9,74.2 31.33,74.2
  Top 0.406: v19.7,64.6 13.7,64.6 9.6,68.7 v9.6,72.2 10.6,73.2 13.4,73.2 14.6,74.4 v14.6,75.9 | LM1117.1 5.85,79.85 v5.9,79.9 | DC15.1 26.95,35.15 31.75,39.95 31.75,40.65 31.9,40.5 v38.9,40.5
  Top 0.61: U2.38 48.95,33.1 | 48.95,33.1 v50.8,33.1 | 47.85,33.1 U2.37 47.85,25.53 X1.2 X1.5 | 47.85,33.1 48.95,33.1 | U2.36 43.15,33.1 | 43.15,33.1 v44.8,33.1 | v44.8,33.1 47.85,33.1 | 42.1,33.1 42.05,33 U2.35 42.05,22.05 41.45,21.45 DC6.1 DC7.1 26.05,21.45 v24.1,23.4 | 42.1,33.1 43.15,33.1 | 42.1,33.1 v38.9,33.1 v38.9,40.5 | v44.8,40.5 v50.8,40.5 | v44.8,47.7 45.8,47.7 v50.8,47.7 v50.8,40.5 | X1.4 X1.3 51.15,26.53 U2.40 51.15,32.75 v50.8,33.1 | v44.8,40.5 v38.9,40.5 | v50.8,40.5 v50.8,33.1 | v50.8,33.1 50.9,33 U2.1 | v38.9,40.5 v38.9,47.7 v44.8,47.7 | v44.8,40.5 v44.8,33.1 | v44.8,47.7 v44.8,40.5
  Top 1.016: JP7.2 14.9,54.4 15.8,53.5 C9.- | C2.- 37.6,65.6 v39.1,67.1
  Top 1.27: JP7.2 JP9.2
  Bottom 0.254: C8.1 C7.1 28.7,90.5 29.5,90.5 | C8.1 27.79,86.6 | 19.7,101.7 19.7,98 | 19.7,98 19.7,95 R24.1 | v29.5,92.9 27.5,92.9 26.1,94.3 | 44.8,92.9 v44.9,92.8 | R24.1 20.6,93.4 19.6,92.4 19.6,90.7 | v34,76.8 35.1,77.9 v35.1,81.7 | 19.6,90.7 v19.6,89.9 | v26.2,25.9 26.2,25.5 v24.1,23.4 | 36.5,86.7 DC18.1 37.35,86.35 v38.3,87.3 | v27.3,95.3 27.1,95.3 26.1,94.3 | v29.5,92.9 v35.1,92.9 | 38.3,92.9 v40.7,92.9 | v35.1,92.9 37.3,92.9 | 37.3,92.9 38.3,92.9 | v40.7,92.9 40.7,90.4 | 40.7,90.4 v40.7,87.3 | v40.7,87.3 40.7,84.2 | 40.7,84.2 40.7,82.9 | 40.7,82.9 v40.7,81.7 | v35.1,81.7 v40.7,81.7 | v35.1,81.7 v35.1,84.1 35.1,84.2 v38.2,84.2 40.7,84.2 | v38.3,87.3 v40.7,87.3 | v35.1,92.9 v35.1,90.5 v31.9,90.5 29.5,90.5 | v38.3,90.4 38.3,92.9 | 29.5,84.5 29.49,84.49 29.5,84.49 v29.5,83.7 29.5,86.8 | v35.1,81.7 v31.5,81.7 | R9.1 19.7,98 | R23.2 19.7,101.7 | v40.7,81.7 41.85,80.55 42.3,80.55 v42.3,77.9 41,76.6 DC37.2 DC38.2 | IC3.5 10.65,68.05 9.15,69.55 DC20.1 9,70.45 9,71.9 | DC19.1 17.95,70 C10.- | v42.7,95.7 42.7,94.9 v40.7,92.9 | v40.7,92.9 40.8,92.8 v44.9,92.8 | 37.3,92.9 v37.3,102.6 37.3,104.95 | 19.7,101.7 19.7,105.05 19,105.75 DC10.1 | 23.4,94.3 26.1,94.3 | v23.4,97.9 23.4,94.3 | R24.1 20.8,94.3 23.4,94.3 | 30,104.95 DC22.1 DC17.1 DC28.2 DC27.2 DC26.2 41.9,104.95 DC25.2 44,105.55 44.52,106.08 | 30,104.95 DC14.1 | 30,104.95 29.5,105.45 DC16.1 26.4,105.45 DC12.1 24.65,106.15 23.75,107.05 23.75,108.25 26.25,110.75 | 44.52,106.08 DC24.2 45.9,106.15 | C8.1 29.5,86.8 | 29.5,86.8 31.4,86.8 v31.9,87.3 | v29.5,92.9 29.5,90.5 | v38.3,90.4 v38.3,87.3 | v38.3,90.4 40.7,90.4 | v44.9,92.8 44.9,98.2 | v47.6,82.9 40.7,82.9 | DC36.1 DC33.1 50.85,101.15 51.9,102.2 54.35,102.2 DC34.1
  Bottom 0.254: DC36.1 DC35.1 DC31.2 DC32.2 DC29.2 DC30.2 50.85,85.15 52.15,83.85 DC39.1 53.45,84.1 JP2.2 | DC36.1 50.65,98.2 44.9,98.2 | 26.25,110.75 26.3,110.8 DC13.1 25.95,110.85 | 24.1,111.8 24.9,111.8 25.95,110.75 26.25,110.75 | BOOTLOAD.6 24.14,111.84 24.1,111.8 | 15.84,111.8 GND.6 GND.4 GND.2 GND.1 GND.3 GND.5 15.84,111.8 | 24.1,111.8 15.84,111.8 | 45.9,106.15 45.9,108.62 JP4.1 | DC23.2 50.1,109.1 50.7,108.5 50.7,106.25 50.6,106.15 | JP1.5 56.48,111.13 DC11.2 53.85,107.55 52.45,106.15 50.6,106.15 | v2.2,72.7 3,71.9 9,71.9 | v9.6,72.2 9.3,71.9 9,71.9 | v29.8,51.1 33.2,47.7 v38.9,47.7 | 44.9,98.2 44.9,105.7 44.52,106.08 | 50.6,106.15 45.9,106.15 | U$1.GND 14.95,96.65 13.5,95.2 13.5,91.5 14.3,90.7 19.6,90.7
  Bottom 0.406: R45.1 18.69,44.09 IC2.5 | C4.- 9.01,78.46 | C4.- 7.16,79.9 v5.9,79.9 4.7,81.1 4.7,82.1 | C3.- 14.6,78 | 14.6,78 9.06,78 C4.- | v14.6,75.9 14.6,78 | 4.7,82.1 4.7,87.4 6,88.7 I2C.4 8.7,89.4 10.8,91.5 13.5,91.5 | 4.7,82.1 JP10.1
  Bottom 0.61: C1.- 17.75,23.4 v24.1,23.4 | IC1.5 44.7,65.5 44.7,63.8 | 44.7,63.8 44.7,62.1 | 44.7,62.1 IC1.3 | 44.7,62.1 44.8,62 v44.8,47.7 | v51.3,63.8 44.7,63.8
  Bottom 0.813: 39.1,65.51 v39.1,67.1 v38.3,66.3 38.31,66.3 IC1.5
  Bottom 1.016: 14.9,48.8 8.9,48.8 8.9,45.4 | 14.9,48.8 IC2.3 21.6,48.8 D1.A | IC2.5 8.9,45.4 | JP7.2 14.9,48.8 | C1.- 7.2,33.65 7.2,43.7 8.9,45.4 | 39.1,65.51 IC1.5 | D11.A 18.4,60.9 18.3,60.9
  Bottom 1.27: 19.6,62.2 18.3,60.9 17.9,60.5 17.9,58.2 16.73,57.03 JP7.2 | D11.A v19.7,64.6 17.95,66.35 C10.-
  pour Top (isolate 0.254, rank 2): 0,116.3 0,17.7 60.4,17.7 60.4,116.3
  pour Bottom (isolate 0.254, rank 2): 0,116.3 0,17.7 60.4,17.7 60.4,116.3
N$1
  Top 0.406: U2.31 35,29.1 30.4,24.5 20.5,24.5 18.8,26.2 18.8,32.2 20.63,34.03 U$2.SIM_GND
N$2
  Top 0.406: U2.27 31.5,37.4 27.35,33.25 DC15.2 24.41,32.77 U$2.SIM_VDD
N$3
  Top 0.406: R10.1 29.4,31.3 30.6,32.5 30.6,34.7 32.2,36.3 U2.28
N$4
  Top 0.406: R11.1 29.9,27.7 32.9,30.7 32.9,33.6 33.4,34.1 U2.30
N$5
  Top 0.406: JP12.1 JP14.1 28.77,12.81 JP13.1
  Bottom 0.406: DC8.1 42.2,11.3 40.69,12.81 JP12.1
  pour Bottom: 24.6,17.7 24.6,0 45.4,0 45.4,17.7
  pour Top: 24.6,0 24.6,17.7 45.4,17.7 45.4,0
N$6
  Top 0.406: U$2.SIM_RST 23.23,30.23 24.3,31.3 R10.2
N$7
  Top 0.254: LED2.A R25.1
N$8
  Top 0.254: R33.1 45.25,114.3 52.7,114.3 | U1.1 41.1,95.8 50.4,105.1 50.4,108.6 51.4,109.6 52,109.6 52.7,110.3 52.7,114.3 | R50.2 57.9,113.4 57,114.3 52.7,114.3
N$9
  Top 0.254: U1.5 39.1,96.6 44.6,102.1 R32.2
N$10
  Bottom 0.254: R24.2 R7.1 18.1,96.1 17.6,96.6 17.6,97.1 16.96,97.74 U$1.SCK
N$11
  Top 0.254: U1.6 38.6,96.9 42.5,100.8 R31.2
N$12
  Bottom 0.254: R9.2 R6.1 18.75,99.95 U$1.DIN
N$13  (via drill 0.6)
  Top 0.254: U1.30 26.1,91.3 25.7,91.7 25.7,96.4 25.3,96.8 21.1,96.8 19.6,95.3 19.6,92.5 18.6,91.5 17.2,91.5 16.8,91.9 9.3,91.9 | v11.4,71.9 11.4,70.2 12.8,68.8 19.7,68.8 24.4,64.1 24.4,45.8 D2.A 25.1,45.7 | JP1.4 53.94,108.66 R16.2
  Top 0.406: v2.8,89.2 5.5,91.9 9.3,91.9 9.3,101.4 10.9,103 16.2,103 17.5,104.3 17.5,111.51 BOOTLOAD.2
  Bottom 0.254: 51.57,108.88 DC11.1 51.95,109.35 53.94,111.34 JP1.4 | v11.4,71.9 11.2,71.9 9.9,73.2 3.5,73.2 2.3,74.4 2.3,88.7 v2.8,89.2
  Bottom 0.406: BOOTLOAD.2 20.59,114.7 52.1,114.7 53.94,112.86 JP1.4
N$14
  Top 0.406: JP12.4 36.91,5.19 36,6.1 36,9.3 35.03,10.27 JP14.2 31.47,10.27 30.3,9.1 30.3,7.5 29.26,6.46 JP13.3
  Bottom 0.406: DC8.2 42.2,6.3 41.09,5.19 JP12.4
N$15
  Bottom 0.406: JP13.2 29.5,9 30.77,7.73 JP14.3
N$16  (via drill 0.6)
  Top 0.254: v28.3,101.5 28.3,101.2 31.1,98.4 U1.21 | BOOTLOAD.3 21.6,101.7 v22,101.3
  Bottom 0.254: R6.2 21.3,99.9 22,100.6 v22,101.3 28.1,101.3 v28.3,101.5
N$17  (via drill 0.6)
  Top 0.254: U1.20 31.6,99.8 v29.9,101.5 v27.9,103.5
  Bottom 0.254: R7.2 20.8,96.1 22,97.3 22,98.1 23,99.1 28.6,99.1 29.9,100.4 v29.9,101.5 | v27.9,103.5 27.1,104.3 25.1,104.3 23,106.4 23,109.39 BOOTLOAD.5
N$18  (via drill 0.6)
  Top 0.254: v28.9,65.1 30.2,65.1 32.1,63.2 46.2,63.2 48.2,65.2 48.2,73.95 48.02,74.17 | R1.1 18.8,71.3 v22.4,67.7 | U1.82 47.5,84.3 48.9,82.9 48.9,75.05 48.02,74.17 | 48.02,74.17 DC21.1
  Bottom 0.254: v28.9,65.1 28,66 24.1,66 v22.4,67.7
N$19
  Top 1.016: JP7.1 JP8.1
  Bottom 0.254: 11.7,63.3 11.65,63.35 IC3.4
  Bottom 1.27: JP7.1 13.93,59.57 11.7,61.8 11.7,63.3
  pour Top (no thermals): 21.7,61.8 arc-180 21.7,58.2 14.3,58.2 arc-180 14.3,61.8
N$20  (via drill 0.6)
  Top 0.254: U1.19 32.1,100.9 v31.5,101.5
  Bottom 0.254: v31.5,101.5 31.5,102.2 31.1,102.6 27.9,102.6 27.3,102 22.7,102 21.2,103.5 R8.2
N$21
  Top 0.61: U2.39 50.05,22.65 X1.1
N$22
  Top 0.254: U1.18 32.6,102 31.3,103.3 29.45,103.3 27.8,104.95 R13.2
N$23
  Top 0.254: U1.12 35.6,102.3 37,103.7 37.4,103.7 38.5,104.8 R22.2
N$25  (via drill 0.6)
  Top 0.254: R26.1 8.8,53.8 6.7,55.9 6.7,58.4 7.87,59.57 JP9.1 12.03,62.9 20.4,62.9 21.7,64.2 v21.7,65 | v24.3,71.2 25,71.2 R56.2
  Bottom 0.254: v21.7,65 21.2,65.5 21.2,69.8 22.6,71.2 v24.3,71.2
  Bottom 1.27: D3.A 7.51,60.76 JP9.1
N$26
  Top 0.254: R27.2 48.8,100.5 47,98.7 47,92.7 45.6,91.3 U1.96
N$27
  Top 0.254: R26.2 7,48.45 LED4.A
N$28  (via drill 0.6)
  Top 0.254: R1.2 13.7,71.5 13.65,71.45 v13,70.8
  Bottom 0.254: IC3.7 13.54,70.27 v13,70.8
N$29
  Top 0.406: U$2.SIM_CLK 22.05,27.7 R11.2
N$30
  Top 0.254: U1.33 23.54,89.8 O1.2
  Bottom 0.406: C7.2 24.76,90.64 O1.2
N$31
  Top 0.254: U1.34 25.3,89.3 22.7,86.7 O1.1
  Bottom 0.406: C8.2 24.67,85.56 O1.1
N$32
  Top 0.254: U1.13 35.1,102.9 36.2,104 R21.2
N$33
  Top 0.254: U1.97 45.3,91.8 46.5,93 46.5,99.4 49,101.9 54.65,101.9 R28.2
N$34
  Top 0.254: U1.94 46.3,90.3 48,92 48,94.6 49.7,96.3 R34.2
N$35
  Bottom 0.254: R8.1 R23.1 18.3,101.7 17.64,101.04 U$1.CS
N$36
  Top 0.254: R19.2 U1.15
N$37
  Top 0.254: U1.16 33.6,103.35 R20.2
N$38
  Top 0.254: U1.17 33.1,102.6 31.9,103.8 31.05,103.8 R12.2
N$39
  Top 0.254: R25.2 23.6,99.9 27,96.5 28.6,96.5 29.1,96 U1.25
N$40
  Top 0.254: U1.46 26.2,83.3 25.7,82.8 25.7,79.8 23,77.1 R14.2
N$41
  Top 0.254: U1.45 26,83.8 25.1,82.9 25.1,80.1 24,79 R15.2
N$42
  Top 0.254: R29.2 22.6,70.7 | 22.6,70.7 26.1,67.2 26.1,56.8 U2.21 | R14.1 20.9,72.4 22.6,70.7
N$43
  Top 0.254: U2.22 32.4,46.8 25.2,54 25.2,66.7 19.9,72 19.9,77.7 R15.1
N$44
  Top 0.254: JP5.8 56.46,91.1 53.85,91.1 DC29.1 R40.1
  Bottom 0.254: DC29.1 53.7,90.95 53.7,91 53.8,91.1 56.46,91.1 JP5.8
N$45
  Top 0.254: U1.23 30.1,96.9 28.6,98.4 27.6,98.4 25.4,100.6 25.4,105.85 R4.2
N$46
  Bottom 0.406: JP12.3 37.23,7.73 34.69,5.19 JP14.4
N$47
  Top 0.254: U1.24 29.6,96.4 28.5,97.5 27.2,97.5 24.6,100.1 24.6,109.05 R5.2
N$48
  Top 0.254: U1.95 45.9,90.8 47.5,92.4 47.5,97.3 48.6,98.4 R36.2
N$49  (via drill 0.6)
  Top 0.254: U1.22 30.6,97.7 28.9,99.4 28,99.4 26.6,100.8 v26.6,103.1 | R35.1 11.8,96.1 10.4,97.5 10.4,101 11.3,101.9 16.7,101.9 19.06,104.26 BOOTLOAD.1
  Bottom 0.254: v26.6,103.1 24.3,103.1 19.06,108.34 BOOTLOAD.1
N$50
  Top 0.254: R17.2 51.2,55.3 50.05,54.15 U2.13
N$51
  Top 0.254: R17.1 49.3,57.6 LED6.A
N$52
  Top 0.254: U1.3 40.1,96.6 46.8,103.3 46.8,105.2 46.8,105.6 R41.1
N$53
  Top 0.254: U1.2 40.6,96.2 49,104.6 R42.1 49,105.2
N$54
  Top 0.254: 28.33,112.65 JP4.11 28.43,112.75 DC13.2
  Bottom 0.254: DC13.2 28.43,112.75 JP4.11
N$55
  Top 0.254: R33.2 45.47,111.05 JP1.1
  Bottom 0.254: DC23.1 46.32,109.93 JP1.1
N$56
  Top 0.254: JP4.3 40.2,111.78 40.2,109.8 42.7,107.3 DC25.1
  Bottom 0.254: JP4.3 40.2,111.78 40.2,109.8 42.5,107.5 DC25.1
N$57
  Top 0.254: JP4.5 37.6,111.84 37.6,109.4 38.3,108.7 DC27.1
  Bottom 0.254: JP4.5 37.6,111.84 37.6,109.4 38.3,108.7 DC27.1
N$58
  Top 0.254: JP4.7 32.6,111.84 32.6,107.25 DC22.2
  Bottom 0.254: JP4.7 32.6,111.84 32.6,107.5 DC22.2
N$60
  Top 0.254: R18.1 51.6,103.45 LED5.A
N$61
  Top 0.254: JP4.9 30,111.78 30,109.5 27.8,107.3 DC16.2
  Bottom 0.254: JP4.9 30,111.78 30,109.55 DC16.2
N$62
  Top 0.254: JP4.2 43.93,108.05 DC24.1
  Bottom 0.254: JP4.2 43.93,108.05 DC24.1
N$63
  Top 0.254: JP1.2 48.86,110.86 46.8,108.8 R41.2
N$64  (via drill 0.6)
  Top 0.254: v17.9,92.8 R35.2
  Bottom 0.254: U$1.DOUT 17.14,95.56 17.6,95.1 17.6,93.1 v17.9,92.8
N$65
  Bottom 0.813: D11.K 31.6,62.2 L6.1 32.5,61.2 L4.1 33.3,60.4 IC1.2
N$66
  Top 0.254: JP4.6 36.37,106.82 DC28.1
  Bottom 0.254: JP4.6 36.37,107.02 DC28.1
N$67
  Top 0.406: U$2.SIM_DATA 23.86,28.96 24.4,29.5 R47.2
N$68
  Top 0.406: R47.1 29.8,29.5 31.8,31.5 31.8,34.4 32.6,35.2 U2.29
N$69
  Top 0.254: JP4.8 33.83,107.32 | 33.83,107.32 33.83,106.92 | DC17.2 33.83,107.32
  Bottom 0.254: JP4.8 33.83,107.12 DC17.2
N$70
  Top 0.254: JP4.10 31.29,108.24 DC14.2
  Bottom 0.254: JP4.10 31.29,108.29 29.9,106.9 DC14.2
N$71
  Top 0.254: JP4.12 27.32,109.1 26.75,109.1 DC12.2
  Bottom 0.254: DC12.2 25.7,107.48 JP4.12
N$72
  Top 0.406: JP16.1 7.97,12.71 JP17.1 JP15.1
  Bottom 0.406: JP15.1 19.79,12.71 21.5,11 DC9.1
  pour Bottom: 3.8,17.7 3.8,0 24.6,0 24.6,17.7
  pour Top: 3.8,17.7 3.8,0 24.6,0 24.6,17.7
N$73
  Top 0.254: JP4.4 38.91,109.39 40.4,107.9 DC26.1
  Bottom 0.254: JP4.4 38.91,109.39 40.4,107.9 DC26.1
N$74
  Top 0.254: JP1.3 51.4,111.1 49,108.7 R42.2
N$75
  Top 0.254: U1.7 38.1,97.3 40.4,99.6 R30.2
N$76
  Top 0.254: U1.84 48.2,85.3 50.1,83.4 50.1,62.1 49.4,61.4 R44.2 45.1,60.4 R43.2
N$77
  Bottom 1.016: IC2.2 24.6,50.5 D1.K 26.2,49.9 29.8,46.3 29.8,39.3 | L3.1 29.8,39.3 | 29.8,39.3 29.8,39 L2.1
N$78
  Bottom 0.406: IC2.4 20.5,47.1 21.2,46.4 21.2,43.2 20.2,42.2 R45.2 | 19.2,42.2 R45.2 | R45.2 R46.1
N$79
  Top 0.254: R51.1 54.19,86.64 JP2.3
  Bottom 0.254: DC39.2 54.09,86.64 JP2.3
N$80
  Top 0.254: I2C.1 16.76,88.25 R49.2
N$81
  Top 0.254: I2C.2 13.77,87.18 R48.2
N$82
  Top 0.406: JP16.3 8.46,6.36 9.6,7.5 9.6,8.8 10.97,10.17 JP17.2 14.23,10.17 15.4,9 15.4,6.2 16.51,5.09 JP15.4
  Bottom 0.406: DC9.2 21.5,6.7 19.89,5.09 JP15.4
N$83
  Bottom 0.406: JP17.4 14.19,5.09 16.73,7.63 JP15.3
N$84
  Bottom 0.406: JP16.2 9.2,8.9 10.47,7.63 JP17.3
N$85
  Top 0.254: U2.10 56.4,46.8 57.6,48 57.6,52.9 T1.3
N$86
  Top 0.254: T1.1 55.95,59.85 R2.2 55.8,61.2 54.8,62.2 R3.2
N$87  (via drill 0.6)
  Top 0.254: R3.1 54.6,64.8 v54.1,65.3 | U1.74 40.6,73.8 44.1,70.3 v44.1,68.3
  Bottom 0.254: v44.1,68.3 44.3,68.1 52.7,68.1 54.1,66.7 v54.1,65.3
N$88
  Top 0.254: D2.K 32.4,42.4 U2.26
N$89
  Top 0.254: JP5.6 56.5,93.6 53.35,93.6 DC31.1 R37.1
  Bottom 0.254: DC31.1 53.35,93.6 56.5,93.6 JP5.6
N$90
  Bottom 0.254: 14.1,63.3 14.15,63.35 IC3.1
  Bottom 1.27: D3.K 9.42,65.5 13.2,65.5 14.1,64.6 14.1,63.3
N$91
  Bottom 0.254: DC20.2 12.27,69.08 IC3.6
N$92
  Top 0.254: JP5.4 56.54,96.1 54.6,96.1 54,96.7 54,97.15 DC36.2 R36.1
  Bottom 0.254: DC36.2 54,97.15 54,96.7 54.6,96.1 56.54,96.1 JP5.4
N$93
  Top 0.254: DC34.2 57.77,100.68 JP5.2
  Bottom 0.254: DC34.2 57.77,100.68 JP5.2
N$94
  Top 0.254: U1.44 25.5,84.3 24.6,83.4 24.6,82.1 24.2,81.7 21.15,81.7 R48.1
N$95
  Top 0.254: R49.1 20,85.45 20,83.8 21.5,82.3 23.7,82.3 24.1,82.7 24.1,83.8 25.1,84.8 U1.43
N$96
  Top 0.254: R39.1 53.34,87.9 JP5.7
  Bottom 0.254: DC30.1 53.34,87.9 JP5.7
N$97
  Top 0.254: R38.1 52.18,92.33 JP5.5
  Bottom 0.254: DC32.1 52.98,92.33 JP5.5
N$98
  Top 0.254: R34.1 53.1,96.3 54.53,94.87 JP5.3
  Bottom 0.254: DC35.2 53.1,96.3 54.53,94.87 JP5.3
N$99
  Top 0.254: R27.1 53.5,100.5 55.23,98.77 JP5.1
  Bottom 0.254: DC33.2 53.5,100.5 55.23,98.77 JP5.1
N$100
  Top 0.254: U1.92 47.3,89.3 50.1,92.1 R38.2
N$101
  Top 0.254: U1.93 46.8,89.8 48.5,91.5 48.5,93.2 49.5,94.2 R37.2 49.9,94.2
N$102
  Top 0.254: U1.90 50.45,88.3 R39.2
N$103
  Top 0.254: U1.91 48,88.8 49.2,90 R40.2
N$104  (via drill 0.6)
  Top 0.254: JP2.1 57.34,81.56 58.7,80.2 58.7,76.6 57.2,75.1 51.2,75.1 v51,74.9
  Bottom 0.254: R54.1 50.45,74.9 v51,74.9
N$105
  Bottom 0.254: R52.1 JP3.1
N$106
  Top 0.254: T2.1 51.53,79.42 JP3.2
N$107
  Top 0.254: DC40.1 55.85,77.15 55.3,77.7 55.3,78.5 54.1,79.7 T2.2 53.35,79.9 R53.1
N$108  (via drill 0.6)
  Top 0.254: v42.9,73.1 41.1,74.9 U1.75
  Bottom 0.254: R54.2 46.6,72.95 R55.1 44.35,73.1 v42.9,73.1
N$109
  Top 0.254: U1.89 47.6,87.8 49.6,85.8 R51.2
N$110
  Top 0.254: U1.88 47.2,87.3 50.8,83.7 R53.2
N$111  (1 unrouted)
  Top 0.254: R60.1 26.95,79.3 U1.51
N$112
  Top 0.254: U1.83 47.9,84.8 49.5,83.2 49.5,65.1 46.9,62.5 30.5,62.5 30.1,62.9 R57.2 27.5,66.7 R56.1
N$113
  Top 0.254: U1.64 35.6,78.2 36,77.8 36.9,77.8 37.7,77 R58.2
N$114
  Top 0.254: R59.2 35.1,77.05 U1.63
N$115
  Top 0.254: R58.1 37.7,73.19 JP6.1
  Bottom 0.254: JP6.1 37.36,70.95 DC38.1
N$116
  Top 0.254: R59.1 33.87,72.92 JP6.2
  Bottom 0.254: JP6.2 33.87,70.43 34.8,69.5 40.3,69.5 41,70.2 DC37.1
N$117  (1 unrouted)
  Top 0.254: R61.1 29.6,77.95 U1.52
N$118  (via drill 0.6)
  Top 0.254: R60.2 25.65,77.35 v21.9,73.6 | v18.7,74.6 17.2,76.1 17.2,78.6 14.81,80.99 JP10.4
  Bottom 0.254: v21.9,73.6 19.7,73.6 v18.7,74.6
N$119  (via drill 0.6)
  Top 0.254: R61.2 25.35,75.45 23.9,74 23.9,73.5 v22.9,72.5 | v17.7,73.3 16,75 16,77.5 12.27,81.23 JP10.3
  Bottom 0.254: v22.9,72.5 18.5,72.5 v17.7,73.3
VDD  (via drill 0.6)
  Top 0.254: 36.6,94.1 41.2,94.1 42,93.3 U1.100 43.1,93.55 DC2.1 | 36.6,94.1 U1.10 36.6,98.25 DC5.1 | 36.6,94.1 28.7,94.1 28.3,93.7 28.3,90.8 | 28.3,90.8 U1.31 25.7,90.8 25,91.5 25,94.65 DC4.1 23.9,95 | 34.1,80.5 U1.61 34.1,78.2 33.4,77.5 32.75,77.5 DC1.1 | 34.1,80.5 28.7,80.5 28.3,80.9 28.3,88.3 | 28.3,88.3 28.3,90.8 | 34.1,80.5 41.5,80.5 41.9,80.9 41.9,83.1 42.1,83.3 U1.80 44.4,83.3 45.75,81.95 DC3.1 | v29.4,88.3 28.3,88.3
  Bottom 0.254: v29.4,88.3 L1.2 34.15,88.3
  Bottom 0.406: L1.2 36.15,88.3 DC18.2
  Bottom 0.61: 36.1,88.25 DC18.2
(copper drawn outside any net)
  shapes: Bottom area x2

### Text on the board
tNames: RST | 5V | GND | D11 | D9 | D7 | D17(RX2) | D2 | GND | MISO | MOSI | SCK | D10 | D8 | D6 | D16(TX2) | D3 | D5 | A1 | A0 | A3 | A2 | A5 | A4 | A7 | A6 | OUT | DHT | OUT | DHT | MET | GND | MET | GND | VDD | VDD | MET | MET | DHT | DHT